# Altium schematic sheet Sheet1.SchDoc
size A4
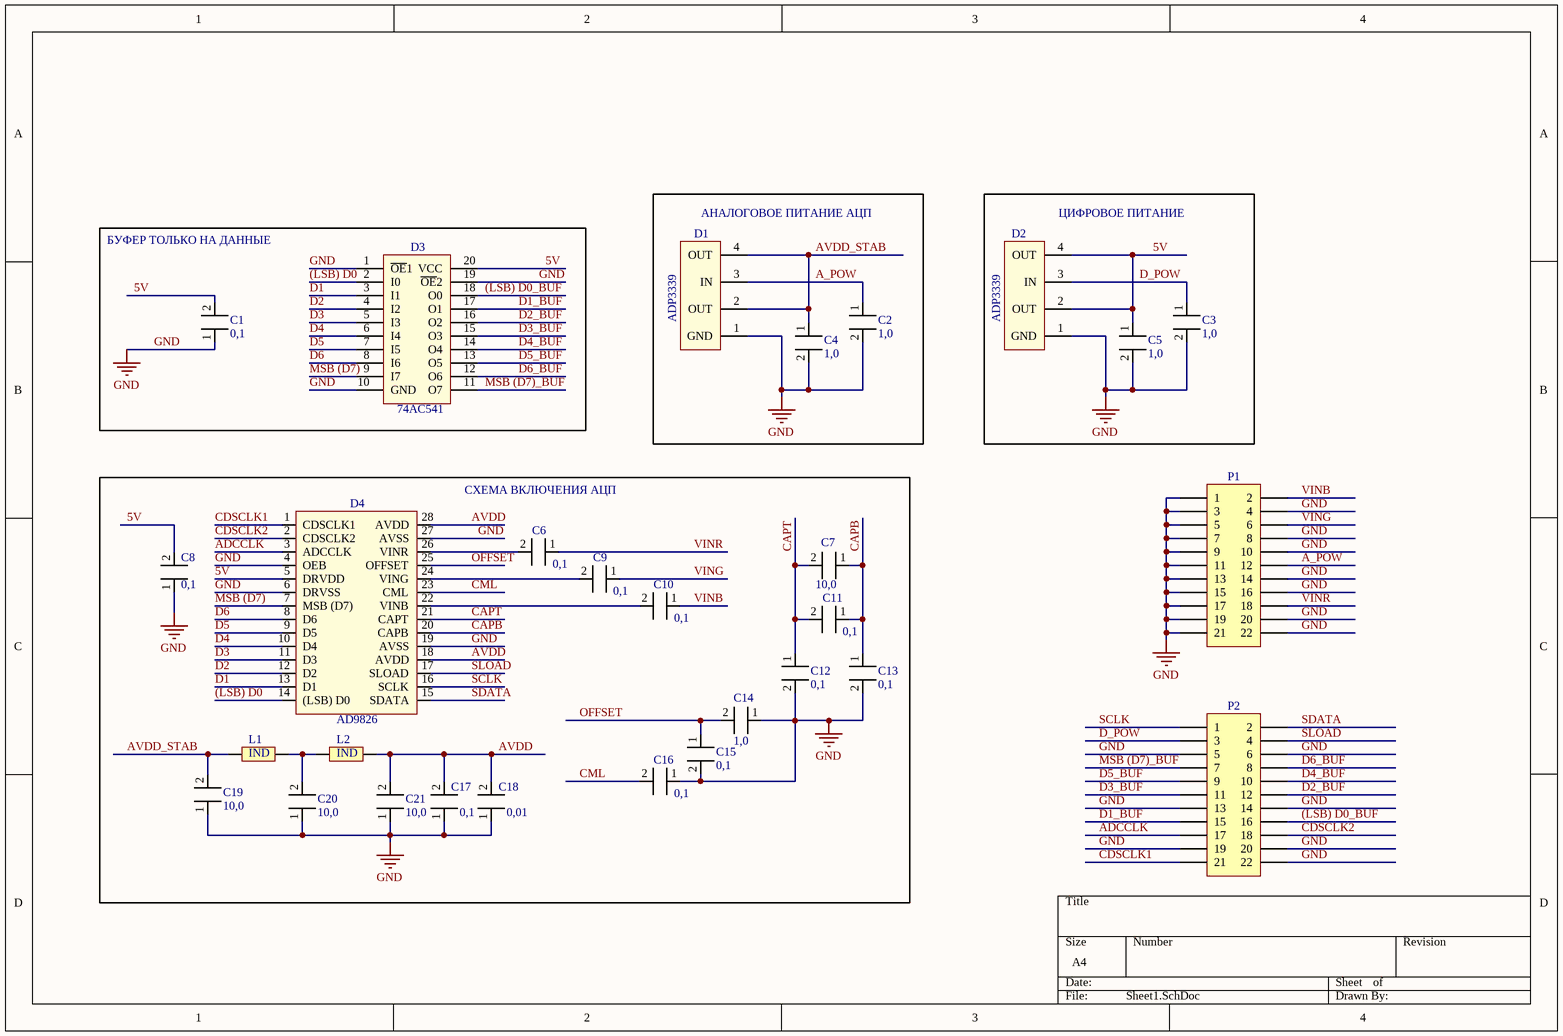
[diagram p0: Sheet1.SchDoc]

## Parts
C1  0,1  [CAP_SMALL]
C2  1,0  [CAP_SMALL]
C3  1,0  [CAP_SMALL]
C4  1,0  [CAP_SMALL]
C5  1,0  [CAP_SMALL]
C6  0,1  [CAP_SMALL]
C7  10,0  [Cap_BIG]
C8  0,1  [CAP_SMALL]
C9  0,1  [CAP_SMALL]
C10  0,1  [CAP_SMALL]
C11  0,1  [CAP_SMALL]
C12  0,1  [CAP_SMALL]
C13  0,1  [CAP_SMALL]
C14  1,0  [CAP_SMALL]
C15  0,1  [CAP_SMALL]
C16  0,1  [CAP_SMALL]
C17  0,1  [CAP_SMALL]
C18  0,01  [CAP_SMALL]
C19  10,0  [Cap_BIG]
C20  10,0  [Cap_BIG]
C21  10,0  [Cap_BIG]
D1  ADP3339  [SOT230P700X180-4N]
D2  ADP3339  [SOT230P700X180-4N]
D3  74AC541  [20S_M]
D4  AD9826  [SSOP-28]
L1  IND  [RES]
L2  IND  [RES]
P1  Header 11X2  [HDR2X11]  (value not drawn)
P2  Header 11X2  [HDR2X11]  (value not drawn)

## Blocks framed on the sheet
АНАЛОГОВОЕ ПИТАНИЕ АЦП: C2 C4 D1
ЦИФРОВОЕ ПИТАНИЕ: C3 C5 D2
БУФЕР ТОЛЬКО НА ДАННЫЕ: C1 D3
СХЕМА ВКЛЮЧЕНИЯ АЦП: C6-C21 D4 L1 L2

## Nets
GND: C1.1 C2.2 C3.2 C4.2 C5.2 C8.1 C12.2 C13.2 C14.1 C15.2 C16.1 C17.1 C18.1 C19.1 C20.1 C21.1 D1.1(GND) D2.1(GND) D3.1(~{OE}1) D3.10(GND) D3.19(~{OE}2) D4.4(OEB) D4.6(DRVSS) D4.19(AVSS) D4.27(AVSS) P1.1 P1.3 P1.4 P1.5 P1.7 P1.8 P1.9 P1.10 P1.11 P1.13 P1.14 P1.15 P1.16 P1.17 P1.19 P1.20 P1.21 P1.22 P2.5 P2.6 P2.13 P2.14 P2.19 P2.20 P2.22
5V: C1.2 C5.1 C8.2 D2.2(OUT) D2.4(OUT) D3.20(VCC) D4.5(DRVDD)
(LSB) D0: D3.2(I0) D4.14((LSB)_D0)
(LSB) D0_BUF: D3.18(O0) P2.16
A_POW: C2.1 D1.3(IN) P1.12
ADCCLK: D4.3(ADCCLK) P2.17
AVDD: C17.2 C18.2 C21.2 D4.18(AVDD) D4.28(AVDD) L2.2
AVDD_STAB: C4.1 C19.2 D1.2(OUT) D1.4(OUT) L1.1
CAPB: C7.1 C11.1 C13.1 D4.20(CAPB)
CAPT: C7.2 C11.2 C12.1 D4.21(CAPT)
CDSCLK1: D4.1(CDSCLK1) P2.21
CDSCLK2: D4.2(CDSCLK2) P2.18
CML: C16.2 D4.23(CML)
D1: D3.3(I1) D4.13(D1)
D1_BUF: D3.17(O1) P2.15
D2: D3.4(I2) D4.12(D2)
D2_BUF: D3.16(O2) P2.12
D3: D3.5(I3) D4.11(D3)
D3_BUF: D3.15(O3) P2.11
D4: D3.6(I4) D4.10(D4)
D4_BUF: D3.14(O4) P2.10
D5: D3.7(I5) D4.9(D5)
D5_BUF: D3.13(O5) P2.9
D6: D3.8(I6) D4.8(D6)
D6_BUF: D3.12(O6) P2.8
D_POW: C3.1 D2.3(IN) P2.3
MSB (D7): D3.9(I7) D4.7(MSB_(D7))
MSB (D7)_BUF: D3.11(O7) P2.7
OFFSET: C14.2 C15.1 D4.25(OFFSET)
SCLK: D4.16(SCLK) P2.1
SDATA: D4.15(SDATA) P2.2
SLOAD: D4.17(SLOAD) P2.4
VINB: C10.1 P1.2
VING: C9.1 P1.6
VINR: C6.1 P1.18
NetC6_2: C6.2 D4.26(VINR)
NetC9_2: C9.2 D4.24(VING)
NetC10_2: C10.2 D4.22(VINB)
NetC20_2: C20.2 L1.2 L2.1

## Library data of the parts
C1-C21 = CAP_SMALL
L1 L2 = RES
P1 P2 = Header 11X2: Header, 11-Pin, Dual row; LatestRevisionDate: 17-Jul-2002; LatestRevisionNote: Re-released for DXP Platform.; Publisher: Altium Limited